# Altium schematic sheet Main.SchDoc: Наименование
size 209 x 297 mm; ApprovedBy: Утвердил; CheckedBy: Проверил; Author: Разработал; CompanyName: Организация; DrawnBy: Н.Контр; Engineer: Т.Контр; SheetNumber: 1; SheetTotal: 5; PageSetup: Record=PageOptions|CenterHorizontal=True|CenterVertical=True|PrintScale=0.94|XCorrection=1.00|YCorrection=1.00|PrintKind=1|BorderSize=5000000|LeftOffset=0|BottomOffset=0|Orientation=1|PaperLength=1000|PaperWidth=1000|Scale=100|PaperSource=7|PrintQuality=-4|MediaType=1|DitherType=10|PaperKind=A4|PrintScaleMode=1; DecimalNumber: Децимальный номер; HeadOfSector: Нач. сектора; MainDevice: Перв.примен.; Name: Наименование; DocumentName: Sheet1.SCHDOC
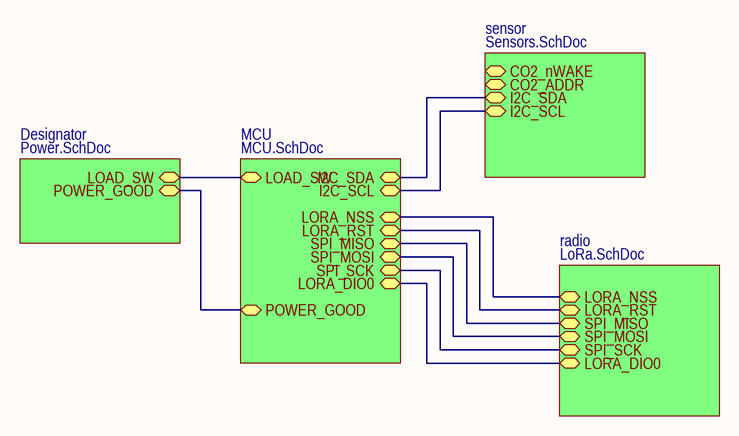
[diagram p0: Main.SchDoc]

## Sub-sheets
Designator = Power.SchDoc: LOAD_SW (bidir), POWER_GOOD (bidir)
MCU = MCU.SchDoc: I2C_SDA (bidir), I2C_SCL (bidir), SPI_MISO (bidir), SPI_MOSI (bidir), SPI_SCK (bidir), LORA_RST (bidir), LOAD_SW (bidir), LORA_DIO0 (bidir), LORA_NSS (bidir), POWER_GOOD (bidir)
radio = LoRa.SchDoc: LORA_DIO0 (bidir), LORA_NSS (bidir), LORA_RST (bidir), SPI_MISO (bidir), SPI_MOSI (bidir), SPI_SCK (bidir)
sensor = Sensors.SchDoc: CO2_ADDR (bidir), I2C_SDA (bidir), CO2_nWAKE (bidir), I2C_SCL (bidir)

## Nets
(unnamed): sheet Designator/LOAD_SW, sheet MCU/LOAD_SW
(unnamed): sheet Designator/POWER_GOOD, sheet MCU/POWER_GOOD
(unnamed): sheet MCU/I2C_SDA, sheet sensor/I2C_SDA
(unnamed): sheet MCU/I2C_SCL, sheet sensor/I2C_SCL
(unnamed): sheet MCU/SPI_MISO, sheet radio/SPI_MISO
(unnamed): sheet MCU/SPI_MOSI, sheet radio/SPI_MOSI
(unnamed): sheet MCU/SPI_SCK, sheet radio/SPI_SCK
(unnamed): sheet MCU/LORA_RST, sheet radio/LORA_RST
(unnamed): sheet MCU/LORA_DIO0, sheet radio/LORA_DIO0
(unnamed): sheet MCU/LORA_NSS, sheet radio/LORA_NSS

## Notes on the sheet
- Перв.примен.
- Справ.№
- Подп. и дата
- Инв.№ дубл.
- Взам.инв.№
- Подп.и дата
- Разраб.
- Изм.
- Лист
- № докум.
- Подп.
- Дата
- Лит.
- Масштаб
- Масса
- Т.контр.
- Пров.
- ПРИНЦИПИАЛЬНАЯ
- СХЕМА   ЭЛЕКТРИЧЕСКАЯ
- Листов
- Инв.№ подл.
- Утв.
- Н.контр.
- Нач.сект.
- Копировал
- Формат  A3